# Altium schematic sheet Microcontroller.SchDoc
size A4; SheetNumber: 2; SheetTotal: 5
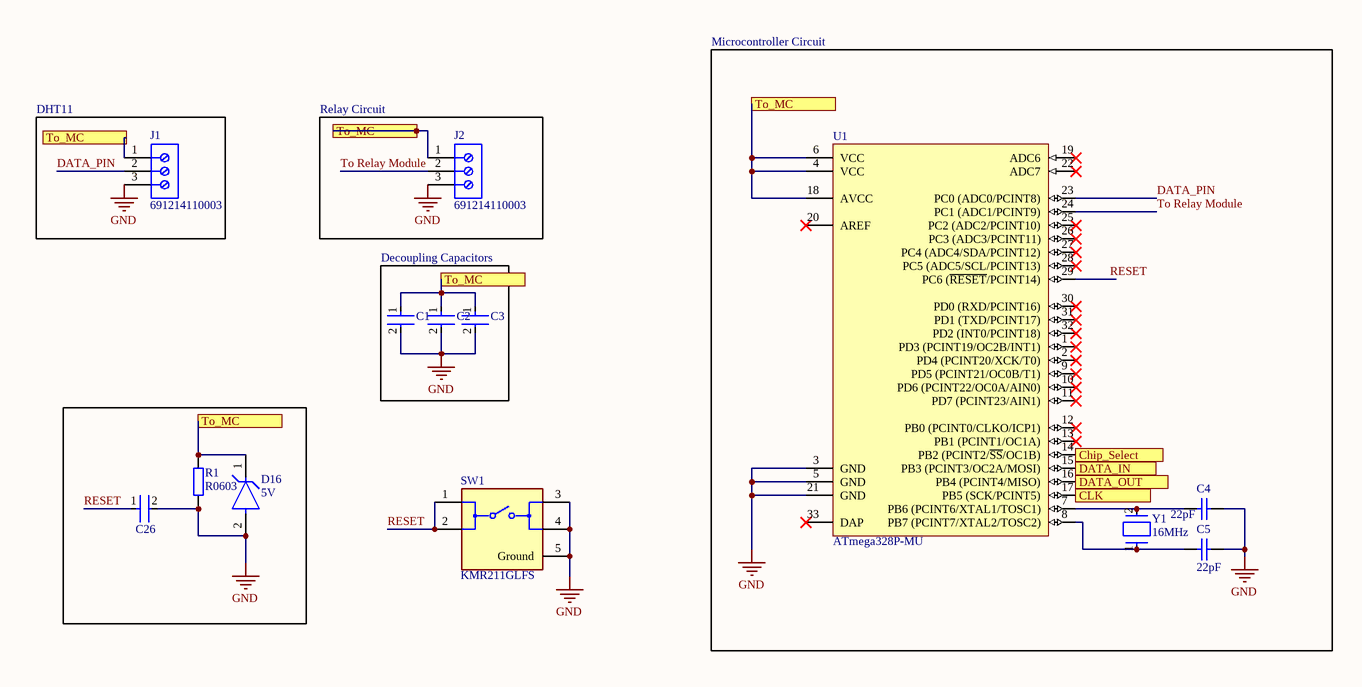
[diagram p0: Microcontroller.SchDoc, left]

## Parts
C1  GRM033C71C104ME14D  [FP-GRM033-0_03-IPC_C]  (value not drawn)
C2  GRM033C71C104ME14D  [FP-GRM033-0_03-IPC_C]  (value not drawn)
C3  GRM033C71C104ME14D  [FP-GRM033-0_03-IPC_C]  (value not drawn)
C4  22pF  [CAPC1608X90X35ML10T15]
C5  22pF  [CAPC1608X90X35ML10T15]
C26  GRM033C71C104ME14D  [FP-GRM033-0_03-IPC_C]  (value not drawn)
D16  5V  [FP-SMA-MFG]
J1  691214110003  [691214110003]
J2  691214110003  [691214110003]
R1  R0603  [RES_0603]
SW1  KMR211GLFS  [FP-KMR211GLFS-MFG]
U1  ATmega328P-MU  [32M1-A_L]
Y1  16MHz  [FP-ABM3-MFG]

## Blocks framed on the sheet
Microcontroller Circuit: C4 C5 U1 Y1
DHT11: J1
Relay Circuit: J2
Decoupling Capacitors: C1-C3

## Ports
Chip_Select, CLK (out), DATA_IN, DATA_OUT (in), To_MC

## Nets
GND: C1.2 C2.2 C3.2 C4.2 C5.2 C26.2 D16.2(A) J1.3 J2.3 R1.1 SW1.3 SW1.4 SW1.5(Ground) U1.3(GND) U1.5(GND) U1.21(GND)
Chip_Select: U1.14(PB2_(PCINT2/~{SS}/OC1B)) ; port Chip_Select
CLK: U1.17(PB5_(SCK/PCINT5)) ; port CLK
DATA_IN: U1.15(PB3_(PCINT3/OC2A/MOSI)) ; port DATA_IN
DATA_OUT: U1.16(PB4_(PCINT4/MISO)) ; port DATA_OUT
DATA_PIN: J1.2 U1.23(PC0_(ADC0/PCINT8))
RESET: C26.1 SW1.1 SW1.2 U1.29(PC6_(~{RESET}/PCINT14))
To Relay Module: J2.2 U1.24(PC1_(ADC1/PCINT9))
To_MC: C1.1 C2.1 C3.1 D16.1(C) J1.1 J2.1 R1.2 U1.4(VCC) U1.6(VCC) U1.18(AVCC) ; port To_MC
NetC4_1: C4.1 U1.7(PB6_(PCINT6/XTAL1/TOSC1)) Y1.2
NetC5_1: C5.1 U1.8(PB7_(PCINT7/XTAL2/TOSC2)) Y1.1

Not connected (* = marked no-connect by the designer): U1 1(PD3_(PCINT19/OC2B/INT1))* 2(PD4_(PCINT20/XCK/T0))* 9(PD5_(PCINT21/OC0B/T1))* 10(PD6_(PCINT22/OC0A/AIN0))* 11(PD7_(PCINT23/AIN1))* 12(PB0_(PCINT0/CLKO/ICP1))* 13(PB1_(PCINT1/OC1A))* 19(ADC6)* 20(AREF)* 22(ADC7)* 25(PC2_(ADC2/PCINT10))* 26(PC3_(ADC3/PCINT11))* 27(PC4_(ADC4/SDA/PCINT12))* 28(PC5_(ADC5/SCL/PCINT13))* 30(PD0_(RXD/PCINT16))* 31(PD1_(TXD/PCINT17))* 32(PD2_(INT0/PCINT18))* 33(DAP)*

## Library data of the parts
C1-C3 C26 = CMP-06035-061412-1: Chip Multilayer Ceramic Capacitors for General Purpose, 0201, 0.10uF, X7S, 22%, 20%, 16V; Capacitance: 100nF; Dielectric: X7S; Length: 0.024inch; Tolerance: 20%; Case Code (Metric): 0603; Weight: 1.2E-05oz; Min Operating Temperature: -55°C; Package Quantity: 15000; Voltage Rating: 16V; Termination: SMD/SMT; Max Operating Temperature: 125°C; Case Code (Imperial): 0201; Thickness: 0.013inch; Voltage Rating (DC): 16V; Packaging: Tape and Reel; Width: 0.012inch; Mount: Surface Mount; Height: 0.3mm; Case/Package: 0201
C4 C5 = CMP-2000-04945-1: Chip Capacitor, 22 pF, +/- 5%, 50 V, -55 to 125 degC, 0603 (1608 Metric), RoHS, Tape and Reel; Manufacturer: Murata; Rated Voltage: 50V; Dielectric: C0G; Capacitance: 22pF; Manufacturer URL: http://www.murata.com/; Datasheet Version: Jul-06; Package Reference: 603; Tolerance (%): ±5%; Case Size/Dimension: 0603; Package Description: 2-Pin Surface Mount Device, Body 1.6 x 0.8 mm; Datasheet URL: https://datasheet.ciiva.com/11786/0900766b807a1cab-11786398.pdf
D16 = CMP-12828-000007-1: TVS DIODE 5V 9.2V SMA; Manufacturer: Diodes Inc.; Manufacturer Part Number: SMAJ5.0A-13-F; Peak Pulse Power: 400W; Number Of Channels: 1; Max Junction Temp: +150°C; Peak Pulse Current: 43.5A; Breakdown Voltage: 6.4V; Direction: Unidirectional; Standoff Height: 0.05mm; Device Class L3: unset; Mouser Description: TVS DIODE 5V 9.2V SMA; Device Class L1: Circuit Protection; Temperature Range High: +150°C; Category: Diode; ComponentLink2Description: Datasheet; Temperature Range Low: -55°C; Device Class L2: TVS Diodes; RoHS: TRUE; Automotive: No; Footprint Url: https://www.diodes.com/assets/Package-Files/SMA.pdf; Reverse Standoff Voltage: 5V; Clamping Voltage: 9.2V; Temperature: -55°C to +150°C; Height: 2.4mm; Octopart: https://octopart.com/smaj5.0a-13-f-diodes+inc.-350158; Lead Free: Yes; Digikey Description: TVS DIODE 5V 9.2V SMA; Package: SMA; ComponentLink2URL: https://www.diodes.com/assets/Datasheets/ds19005.pdf
J1 J2 = CMP-1502-02466-2: NexarPartId: 18818289; Number of Levels: 1; Voltage: 300V; Pitch: 3.5052mm; Stripping Length: -6mm; Number of Positions Per Level: 3; Plating: Brass, Steel; Wire/Cable Gauge: 24AWG; Wire Gauge (Min): 16AWG; Current Rating: 10A; Width: 10.9mm; Length: 7.4mm; Housing Material: Nylon; Height: 12.2mm; Min Operating Temperature: -40°C; Contact Plating: Brass, Tin; Packaging: Box; Color: Blue, Green; Number of Contacts: 3; Number of Pins: 3; Voltage Rating: 300V; Termination: Screw; Lead Pitch: 3.5mm; Max Operating Temperature: 105°C; Mount: Through Hole; Contact Material: Brass; RoHS: Compliant; Wire Gauge (Max): 24AWG; Current: 10A; REACH SVHC: Unknown
R1 = RES_0603: Resistor SMD 0603; Manufacturer: *; Manufacturer Part Number: *; Distributor Link: *; LCSC: *
SW1 = CMP-10040-000023-1: SWITCH TACTILE SPST-NO 0.05A 32V; Switch Function: Off-Mom; Throw Configuration: SPST; Switch Travel: 0.2mm; Current Rating: 50mA; Illumination Type: Non-Illuminated; Actuator Length: 0.5mm; Power Rating: 1W; Operating Force: 1.2N; Actuator Type: Standard; Mechanical Life: 200000Cycles; REACH SVHC: No SVHC; Voltage Rating (DC): 32V; Length: 2.8mm; Min Operating Temperature: -40°C; Mount: Surface Mount; Max Voltage Rating (DC): 32V; Width: 2.8mm; Depth: 4.6mm; Packaging: Tape and Reel; Lead Free: Lead Free; Contact Material: Silver; Termination: Gull Wing; Package Quantity: 1; Contact Current Rating: 50mA; Orientation: Straight; Max Operating Temperature: 85°C; Radiation Hardening: No; Max Current Rating: 50mA; Contact Plating: Silver
U1 = CMP-0095-00077-2: 8-bit AVR Microcontroller, 32KB Flash, 1KB EEPROM, 2KB SRAM, 32-pin MLF, Industrial Grade (-40°C to 85°C); PackageReference: 32M1-A; ComponentLink2URL: http://www.atmel.com/dyn/resources/prod_documents/8271.pdf; DatasheetVersion: revD, May-2011; PackageVersion: revE, May-2006; ComponentLink3URL: http://www.atmel.com/dyn/resources/prod_documents/8271S.pdf; ComponentLink1URL: http://www.atmel.com/; PackageDescription: 32-Pin Micro Lead Frame Package (MLF),  5 x 5 x 1.0 mm Body, Pitch 0.50 mm, 3.10mm Exposed Pad; Code_JEDEC: MO-220-VHHD-2; RevisionNote: DatasheetVersion updated. URLs added.; ComponentLink1Description: Manufacturer URL; ComponentLink3Description: ATmega48A/48PA/88A/88PA/168A/168PA/328/328P Summary; ComponentLink2Description: ATmega48A/48PA/88A/88PA/168A/168PA/328/328P Datasheet
Y1 = CMP-27762-004490-1: Crystal 16MHz ±20ppm 18pF SMD-2 5mm x 3.2mm; Frequency Stability: 30ppm; Series Resistance: 40R; Tolerance: 20ppm; Frequency Tolerance: 20ppm; Load Capacitance: 18pF; Resistor Type: Ceramic; Termination: SMD/SMT; Width: 0.126inch; Mount: Surface Mount; RoHS Compliant: Yes; Package Quantity: 1000; Height: 0.051inch; Length: 0.197inch; Frequency: 16MHz; Operating Frequency: 16 MHz; Packaging: Tape and Reel; Max Operating Temperature: 85°C; Series: ABM3; Case/Package: SMD/SMT; Lead Free: Lead Free; ESR (Equivalent Series Resistance): 40R; Number of Pins: 2; Min Operating Temperature: -40°C